# EAGLE schematic pintu (EAGLE 7.4.0)
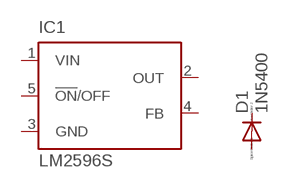
[diagram p0: schematic, sheet 1]

## Parts
D1  1N5400  [DO201-15]
IC1  LM2596S  [TO263-5]
Unconnected: D1.A D1.C IC1.1(VIN) IC1.2(OUT) IC1.4(FB) IC1.5(!ON!/OFF)

## Power pins joined to a net without a drawn wire
GND: IC1.3(GND)

## Library data of the parts
D1 = diode:1N5400: DIODE standard rectifier, 3 A, 50 V (Motorola)
IC1 = national-semiconductor:LM2596: SIMPLE SWITCHER® Power Converter 150 kHz 3A Step-Down Voltage Regulator Source: http://www.national.com/ds/LM/LM2596.pdf; MF: NATIONAL SEMICONDUCTOR; MPN: LM2596S-ADJ/NOPB; OC_FARNELL: 9494367; OC_NEWARK: 41K3842